# Altium schematic sheet ice40.SchDoc
size A3; SheetNumber: 3; SheetTotal: 3
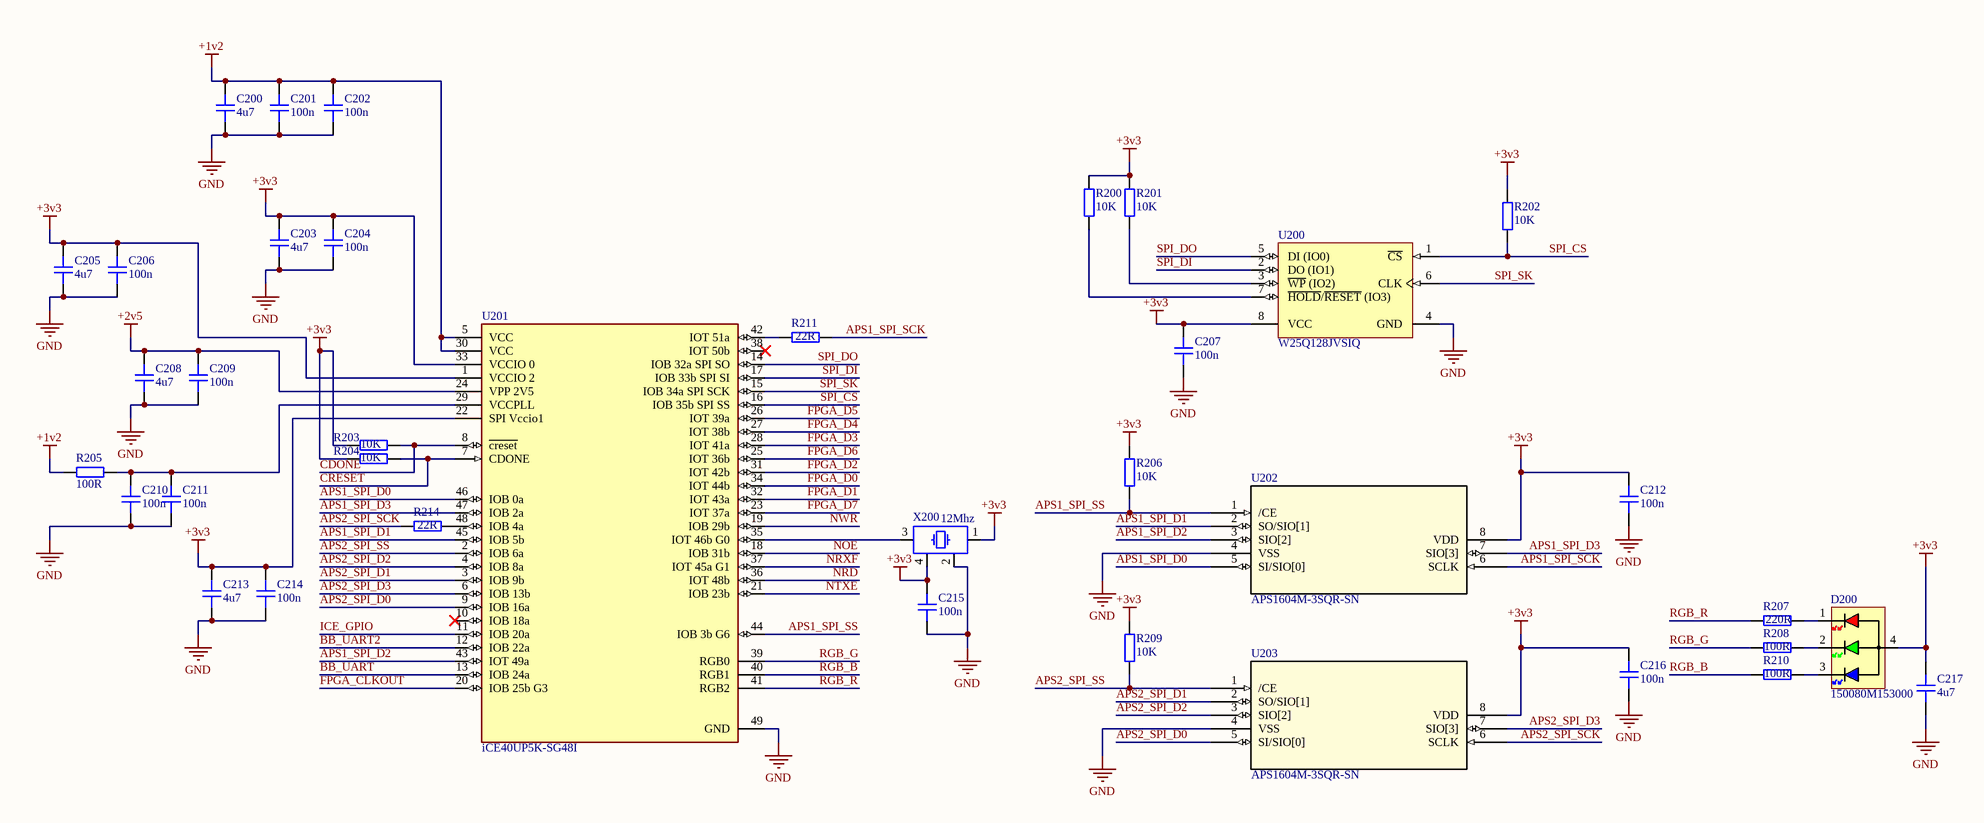
[diagram p0: ice40.SchDoc]

## Parts
C200  4u7  [CAP_0402]
C201  100n  [CAP_0402]
C202  100n  [CAP_0402]
C203  4u7  [CAP_0402]
C204  100n  [CAP_0402]
C205  4u7  [CAP_0402]
C206  100n  [CAP_0402]
C207  100n  [CAP_0402]
C208  4u7  [CAP_0402]
C209  100n  [CAP_0402]
C210  100n  [CAP_0402]
C211  100n  [CAP_0402]
C212  100n  [CAP_0402]
C213  4u7  [CAP_0402]
C214  100n  [CAP_0402]
C215  100n  [CAP_0402]
C216  100n  [CAP_0402]
C217  4u7  [CAP_0402]
D200  150080M153000  [150080M153000]
R200  10K  [RES_0402]
R201  10K  [RES_0402]
R202  10K  [RES_0402]
R203  10K  [RES_0402]
R204  10K  [RES_0402]
R205  100R  [RES_0402]
R206  10K  [RES_0402]
R207  220R  [RES_0402]
R208  100R  [RES_0402]
R209  10K  [RES_0402]
R210  100R  [RES_0402]
R211  22R  [RES_0402]
R214  22R  [RES_0402]
U200  W25Q128JVSIQ  [WINB-SOIC-8_M]
U201  iCE40UP5K-SG48I  [FP-QFN-48-IPC_C]
U202  APS1604M-3SQR-SN  [SOP8L_APS1604M-3SQR-SN_APY]
U203  APS1604M-3SQR-SN  [SOP8L_APS1604M-3SQR-SN_APY]
X200  12Mhz  [XTAL_2520]

## Nets
+1v2: C200.2 C201.2 C202.2 R205.1 U201.5(VCC) U201.30(VCC)
+2v5: C208.2 C209.2 U201.24(VPP_2V5)
+3v3: C203.2 C204.2 C205.2 C206.2 C207.2 C212.2 C213.2 C214.2 C215.1 C216.2 C217.2 D200.4(AC) R200.2 R201.2 R202.2 R203.1 R204.1 R206.2 R209.2 U200.8(VCC) U201.1(VCCIO_2) U201.22(SPI_Vccio1) U201.33(VCCIO_0) U202.8(VDD) U203.8(VDD) X200.1 X200.4
GND: C200.1 C201.1 C202.1 C203.1 C204.1 C205.1 C206.1 C207.1 C208.1 C209.1 C210.1 C211.1 C212.1 C213.1 C214.1 C215.2 C216.1 C217.1 U200.4(GND) U201.49(GND) U202.4(VSS) U203.4(VSS) X200.2
APS1_SPI_D0: U201.46(IOB_0a) U202.5(SI/SIO[0])
APS1_SPI_D1: U201.45(IOB_5b) U202.2(SO/SIO[1])
APS1_SPI_D2: U201.43(IOT_49a) U202.3(SIO[2])
APS1_SPI_D3: U201.47(IOB_2a) U202.7(SIO[3])
APS1_SPI_SCK: R211.2 U202.6(SCLK)
APS1_SPI_SS: R206.1 U201.44(IOB_3b_G6) U202.1(/CE)
APS2_SPI_D0: U201.9(IOB_16a) U203.5(SI/SIO[0])
APS2_SPI_D1: U201.3(IOB_9b) U203.2(SO/SIO[1])
APS2_SPI_D2: U201.4(IOB_8a) U203.3(SIO[2])
APS2_SPI_D3: U201.6(IOB_13b) U203.7(SIO[3])
APS2_SPI_SCK: R214.1 U203.6(SCLK)
APS2_SPI_SS: R209.1 U201.2(IOB_6a) U203.1(/CE)
BB_UART: U201.13(IOB_24a)
BB_UART2: U201.12(IOB_22a)
CDONE: R203.2 U201.8(~{creset})
CRESET: R204.2 U201.7(CDONE)
FPGA_CLKOUT: U201.20(IOB_25b_G3)
FPGA_D0: U201.34(IOT_44b)
FPGA_D1: U201.32(IOT_43a)
FPGA_D2: U201.31(IOT_42b)
FPGA_D3: U201.28(IOT_41a)
FPGA_D4: U201.27(IOT_38b)
FPGA_D5: U201.26(IOT_39a)
FPGA_D6: U201.25(IOT_36b)
FPGA_D7: U201.23(IOT_37a)
ICE_GPIO: U201.11(IOB_20a)
NOE: U201.18(IOB_31b)
NRD: U201.36(IOT_48b)
NRXF: U201.37(IOT_45a_G1)
NTXE: U201.21(IOB_23b)
NWR: U201.19(IOB_29b)
RGB_B: R210.1 U201.40(RGB1)
RGB_G: R208.1 U201.39(RGB0)
RGB_R: R207.1 U201.41(RGB2)
SPI_CS: R202.1 U200.1(~{CS}) U201.16(IOB_35b_SPI_SS)
SPI_DI: U200.2(DO_(IO1)) U201.17(IOB_33b_SPI_SI)
SPI_DO: U200.5(DI_(IO0)) U201.14(IOB_32a_SPI_SO)
SPI_SK: U200.6(CLK) U201.15(IOB_34a_SPI_SCK)
NetC210_2: C210.2 C211.2 R205.2 U201.29(VCCPLL)
NetD200_1: D200.1(CR) R207.2
NetD200_2: D200.2(CG) R208.2
NetD200_3: D200.3(CB) R210.2
NetR200_1: R200.1 U200.7(~{HOLD}/~{RESET}_(IO3))
NetR201_1: R201.1 U200.3(~{WP}_(IO2))
NetR211_1: R211.1 U201.42(IOT_51a)
NetR214_2: R214.2 U201.48(IOB_4a)
NetU201_35: U201.35(IOT_46b_G0) X200.3

Not connected (* = marked no-connect by the designer): U201 10(IOB_18a)* 38(IOT_50b)*

## Library data of the parts
C200 C203 C205 C208 C213 C217 = CAP_0402: Capacitor SMD 0402; Manufacturer Part Number: GRM155R61E475ME15D; Manufacturer: *; Distributor Link: *; LCSC: C2858031; Rating: *; Dielectric: *
C201 C202 C204 C206 C207 C209-C212 C214-C216 = CAP_0402: Capacitor SMD 0402; Manufacturer Part Number: CL05B104KO5NNNC; Manufacturer: *; Distributor Link: *; LCSC: C1525; Rating: *; Dielectric: *
D200 = 150080M153000: RGB LED Common Anode SMD Diffused 0805 Top View; Manufacturer: Wurth; Manufacturer Part Number: 150080M153000; Distributor Link: https://www.mouser.de/ProductDetail/Wurth-Elektronik/150080M153000?qs=5aG0NVq1C4wI5cZ2wabu5A%3D%3D; LCSC: C6785001
R200-R204 R206 R209 = RES_0402: Resistor SMD 0402; Manufacturer Part Number: 0402WGF1002TCE; Manufacturer: *; Distributor Link: *; LCSC: C25744
R205 R208 R210 = RES_0402: Resistor SMD 0402; Manufacturer Part Number: 0402WGF1000TCE; Manufacturer: *; Distributor Link: *; LCSC: C25076
R207 = RES_0402: Resistor SMD 0402; Manufacturer Part Number: 0402WGF2200TCE; Manufacturer: *; Distributor Link: *; LCSC: C25091
R211 R214 = RES_0402: Resistor SMD 0402; Manufacturer Part Number: 0402WGF220JTCE; Manufacturer: *; Distributor Link: *; LCSC: C25092
U200 = CMP-2000-05005-1: 3V 128M-Bit Serial Flash Memory with Dual/Quad SPI & QPI, 2.7 to 3.6 V, -40 to 85 degC, 8-Pin SOIC, RoHS, Tape and Reel; Manufacturer: Winbond; Number of Words: 16777216; Address Bus: 24b; Word Size: 8b; Boot Type: NotRequired; Supply Current: 20mA; Operating Supply Voltage (Max): 3.6V; Sync/Async: Synchronous; Rad Hardened: No; Interface Type: Serial(SPI); Access Time (Max): 7ns; Operating Supply Voltage (Min): 2.7V; Operating Supply Voltage (Typ): 3/3.3V; Programmable: Yes; Density: 134217728Bit; Cell Type: NOR; Package Description: 8-Pin Small Outline Integrated Circuit, Body 5.28 x 5.28 mm, Pitch 1.27 mm; Datasheet URL: http://download.siliconexpert.com/pdfs/2015/11/30/6/42/17/890/win_/manual/3w25q128fv20rev.l2008242015.pdf; Package Reference: SS-8; Package Type: SOICW; Datasheet Version: Rev. L, 08/2015; Manufacturer URL: http://www.winbond.com/hq/index.html?__locale=en; Pin Count: 8; Operating Temperature Classification: Industrial; Operating Temperature (Min): -40C; Program/Erase Volt (Typ): 2.7to3.6V; Operating Temperature (Max): 85C; Mounting: SurfaceMount; Operating Temp Range: -40Cto85C; LCSC: C113767; Manufacturer Part Number: W25Q128JVSIQ
U201 = CMP-17932-000001-1: ICE40-ULTRAPLUS, 5280 LUTS, 1.2V; Manufacturer: Lattice; Propagation Delay: 9ns; Frequency: 48MHz; Max Junction Temp: +100°C; Ram Size: 1024Kbits; Number Of Logic Elements Cells: 5280; Number Of I/Os: 39; Max Supply Voltage: 3.46V; Standoff Height: 0mm; Nominal Supply Current: 2.5-12mA; Min Supply Voltage: 1.14V; Number Of Logic Blocks: 660; Device Class L3: FPGAs - Field Programmable Gate Arrays; Temperature Range High: +100°C; Device Class L1: Integrated Circuits (ICs); Device Class L2: Embedded Processors and Controllers; Ipc Land Pattern Name: QFN50P700X700X90-48; Automotive: No; RoHS: TRUE; Lead Free: Yes; Height: 1mm; ComponentLink2Description: Datasheet; Manufacturer Part Number: iCE40UP5K-SG48I; Temperature Range Low: -40°C; Package: QFN-48; Temperature: -40°C to +100°C; Octopart: https://octopart.com/ice40up5k-sg48i-lattice+semiconductor-87369311; Footprint Url: http://www.latticesemi.com/view_document?document_id=213; Digikey Description: ICE40-ULTRAPLUS, 5280 LUTS, 1.2V; ComponentLink2URL: http://www.latticesemi.com/view_document?document_id=51968; Category: IC; LCSC: C2678152
U202 U203 = APS1604M-3SQR-SN: No Description Available; Mfr_Name: AP Memory; RefDes: RefDes; Type: Type; LCSC: C18214056; Manufacturer Part Number: APS1604M-3SQR-SN
X200 = XTAL_2520: Crystal SMD 2520; Manufacturer Part Number: SX2M12.000B10F20TNN; Manufacturer: *; Distributor Link: *; LCSC: C7431262